# Altium schematic sheet PLCtulam_V1.SchDoc
size A; SheetNumber: 1; SheetTotal: 1
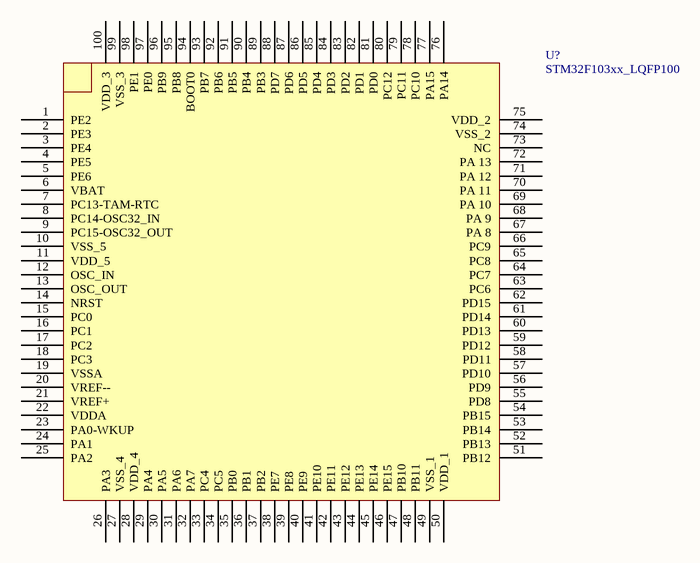
[diagram p0: PLCtulam_V1.SchDoc]

## Parts
U?  STM32F103xx_LQFP100  [STM32_LQFP100]

## Nets

Not connected (* = marked no-connect by the designer): U? 1(PE2) 2(PE3) 3(PE4) 4(PE5) 5(PE6) 6(VBAT) 7(PC13-TAM-RTC) 8(PC14-OSC32_IN) 9(PC15-OSC32_OUT) 10(VSS_5) 11(VDD_5) 12(OSC_IN) 13(OSC_OUT) 14(NRST) 15(PC0) 16(PC1) 17(PC2) 18(PC3) 19(VSSA) 20(VREF--) 21(VREF+) 22(VDDA) 23(PA0-WKUP) 24(PA1) 25(PA2) 26(PA3) 27(VSS_4) 28(VDD_4) 29(PA4) 30(PA5) 31(PA6) 32(PA7) 33(PC4) 34(PC5) 35(PB0) 36(PB1) 37(PB2) 38(PE7) 39(PE8) 40(PE9) 41(PE10) 42(PE11) 43(PE12) 44(PE13) 45(PE14) 46(PE15) 47(PB10) 48(PB11) 49(VSS_1) 50(VDD_1) 51(PB12) 52(PB13) 53(PB14) 54(PB15) 55(PD8) 56(PD9) 57(PD10) 58(PD11) 59(PD12) 60(PD13) 61(PD14) 62(PD15) 63(PC6) 64(PC7) 65(PC8) 66(PC9) 67(PA_8) 68(PA_9) 69(PA_10) 70(PA_11) 71(PA_12) 72(PA_13) 73(NC) 74(VSS_2) 75(VDD_2) 76(PA14) 77(PA15) 78(PC10) 79(PC11) 80(PC12) 81(PD0) 82(PD1) 83(PD2) 84(PD3) 85(PD4) 86(PD5) 87(PD6) 88(PD7) 89(PB3) 90(PB4) 91(PB5) 92(PB6) 93(PB7) 94(BOOT0) 95(PB8) 96(PB9) 97(PE0) 98(PE1) 99(VSS_3) 100(VDD_3)